# EAGLE design UBTB_MIX (EAGLE 9.4.2)
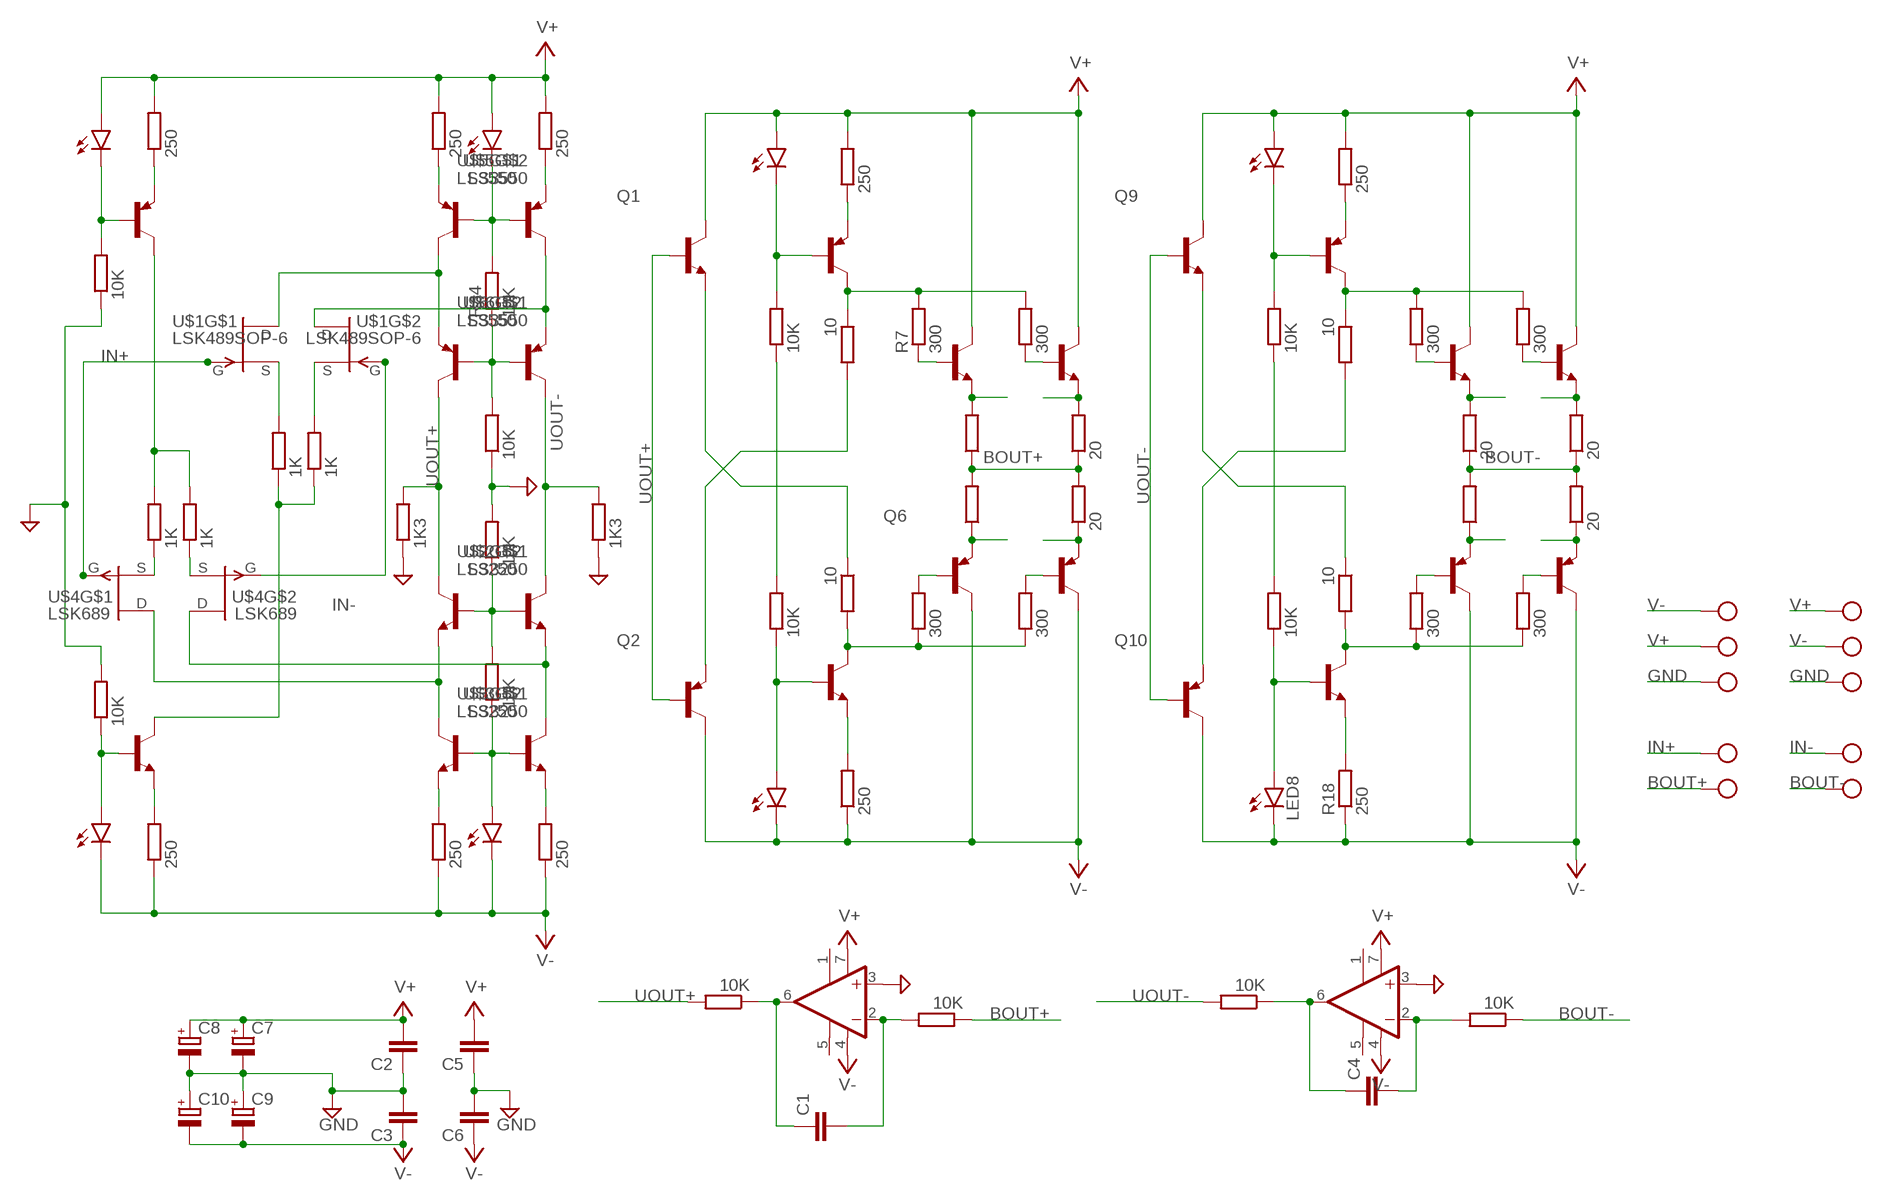
[diagram p0: schematic, sheet 1]

## Parts
C1  C-EUC1206  [C1206]
C2  C-EUC0805  [C0805]
C3  C-EUC0805  [C0805]
C4  C-EUC1206  [C1206]
C5  C-EUC0805  [C0805]
C6  C-EUC0805  [C0805]
C7  CPOL-EUF  [PANASONIC_F]
C8  CPOL-EUF  [PANASONIC_F]
C9  CPOL-EUF  [PANASONIC_F]
C10  CPOL-EUF  [PANASONIC_F]
IC1  OPA627U  [SO08]
IC2  OPA627U  [SO08]
LED1  LEDVWV1206  [LED_SML1206]
LED2  LEDVWV1206  [LED_SML1206]
LED3  LEDVWV1206  [LED_SML1206]
LED4  LEDVWV1206  [LED_SML1206]
LED5  LEDVWV1206  [LED_SML1206]
LED6  LEDVWV1206  [LED_SML1206]
LED7  LEDVWV1206  [LED_SML1206]
LED8  LEDVWV1206  [LED_SML1206]
Q1  TRANSISTOR_BC846-NPN-SOT23-BEC  [TRANSISTOR_SOT23-BEC]
Q2  TRANSISTOR_BC856B-PNP-SOT23-BEC  [TRANSISTOR_SOT23-BEC]
Q3  TRANSISTOR_BC846-NPN-SOT23-BEC  [TRANSISTOR_SOT23-BEC]
Q4  TRANSISTOR_BC856B-PNP-SOT23-BEC  [TRANSISTOR_SOT23-BEC]
Q5  TRANSISTOR_BC846-NPN-SOT23-BEC  [TRANSISTOR_SOT23-BEC]
Q6  TRANSISTOR_BC856B-PNP-SOT23-BEC  [TRANSISTOR_SOT23-BEC]
Q7  TRANSISTOR_BC856B-PNP-SOT23-BEC  [TRANSISTOR_SOT23-BEC]
Q8  TRANSISTOR_BC846-NPN-SOT23-BEC  [TRANSISTOR_SOT23-BEC]
Q9  TRANSISTOR_BC846-NPN-SOT23-BEC  [TRANSISTOR_SOT23-BEC]
Q10  TRANSISTOR_BC856B-PNP-SOT23-BEC  [TRANSISTOR_SOT23-BEC]
Q11  TRANSISTOR_BC846-NPN-SOT23-BEC  [TRANSISTOR_SOT23-BEC]
Q12  TRANSISTOR_BC856B-PNP-SOT23-BEC  [TRANSISTOR_SOT23-BEC]
Q13  TRANSISTOR_BC846-NPN-SOT23-BEC  [TRANSISTOR_SOT23-BEC]
Q14  TRANSISTOR_BC846-NPN-SOT23-BEC  [TRANSISTOR_SOT23-BEC]
Q15  TRANSISTOR_BC856B-PNP-SOT23-BEC  [TRANSISTOR_SOT23-BEC]
Q16  TRANSISTOR_BC856B-PNP-SOT23-BEC  [TRANSISTOR_SOT23-BEC]
Q17  TRANSISTOR_BC846-NPN-SOT23-BEC  [TRANSISTOR_SOT23-BEC]
Q18  TRANSISTOR_BC856B-PNP-SOT23-BEC  [TRANSISTOR_SOT23-BEC]
R1  250  R-EU_MELF0204W  [MINI_MELF-0204W]
R2  250  R-EU_MELF0204W  [MINI_MELF-0204W]
R3  10K  R-EU_MELF0204W  [MINI_MELF-0204W]
R4  10K  R-EU_MELF0204W  [MINI_MELF-0204W]
R5  10  R-EU_MELF0204W  [MINI_MELF-0204W]
R6  10  R-EU_MELF0204W  [MINI_MELF-0204W]
R7  300  R-EU_MELF0204W  [MINI_MELF-0204W]
R8  300  R-EU_MELF0204W  [MINI_MELF-0204W]
R9  300  R-EU_MELF0204W  [MINI_MELF-0204W]
R10  300  R-EU_MELF0204W  [MINI_MELF-0204W]
R11  R-EU_MELF0204W  [MINI_MELF-0204W]
R12  R-EU_MELF0204W  [MINI_MELF-0204W]
R13  20  R-EU_MELF0204W  [MINI_MELF-0204W]
R14  20  R-EU_MELF0204W  [MINI_MELF-0204W]
R15  250  R-EU_MELF0204W  [MINI_MELF-0204W]
R16  10K  R-EU_MELF0204W  [MINI_MELF-0204W]
R17  10K  R-EU_MELF0204W  [MINI_MELF-0204W]
R18  250  R-EU_MELF0204W  [MINI_MELF-0204W]
R19  10K  R-EU_MELF0204W  [MINI_MELF-0204W]
R20  10K  R-EU_MELF0204W  [MINI_MELF-0204W]
R21  10  R-EU_MELF0204W  [MINI_MELF-0204W]
R22  250  R-EU_MELF0204W  [MINI_MELF-0204W]
R23  250  R-EU_MELF0204W  [MINI_MELF-0204W]
R24  10  R-EU_MELF0204W  [MINI_MELF-0204W]
R25  300  R-EU_MELF0204W  [MINI_MELF-0204W]
R26  300  R-EU_MELF0204W  [MINI_MELF-0204W]
R27  300  R-EU_MELF0204W  [MINI_MELF-0204W]
R28  300  R-EU_MELF0204W  [MINI_MELF-0204W]
R29  10K  R-EU_MELF0204W  [MINI_MELF-0204W]
R30  20  R-EU_MELF0204W  [MINI_MELF-0204W]
R31  R-EU_MELF0204W  [MINI_MELF-0204W]
R32  10K  R-EU_MELF0204W  [MINI_MELF-0204W]
R33  10K  R-EU_MELF0204W  [MINI_MELF-0204W]
R34  10K  R-EU_MELF0204W  [MINI_MELF-0204W]
R35  250  R-EU_MELF0204W  [MINI_MELF-0204W]
R36  250  R-EU_MELF0204W  [MINI_MELF-0204W]
R37  1K3  R-EU_MELF0204W  [MINI_MELF-0204W]
R38  1K3  R-EU_MELF0204W  [MINI_MELF-0204W]
R39  1K  R-EU_MELF0204W  [MINI_MELF-0204W]
R40  1K  R-EU_MELF0204W  [MINI_MELF-0204W]
R41  1K  R-EU_MELF0204W  [MINI_MELF-0204W]
R42  1K  R-EU_MELF0204W  [MINI_MELF-0204W]
R43  250  R-EU_MELF0204W  [MINI_MELF-0204W]
R44  250  R-EU_MELF0204W  [MINI_MELF-0204W]
R45  10K  R-EU_MELF0204W  [MINI_MELF-0204W]
R46  10K  R-EU_MELF0204W  [MINI_MELF-0204W]
R47  20  R-EU_MELF0204W  [MINI_MELF-0204W]
R48  10K  R-EU_MELF0204W  [MINI_MELF-0204W]
R49  20  R-EU_MELF0204W  [MINI_MELF-0204W]
R51  10K  R-EU_MELF0204W  [MINI_MELF-0204W]
U$1  LSK489SOP-6  [SOT-23-6]
U$2  LS3250  [SOT-23-6]
U$3  LS3250  [SOT-23-6]
U$4  LSK689  [SOT-23-6]
U$5  LS3550  [SOT-23-6]
U$6  LS3550  [SOT-23-6]
X1  CON-PHOENIX-508_MKDSN1,5/3-5,08  [CON-PHOENIX-508_MKDSN1,5/3-5,08]
X2  CON-PHOENIX-508_MKDSN1,5/3-5,08  [CON-PHOENIX-508_MKDSN1,5/3-5,08]
X3  CON-PHOENIX-508_MKDSN1,5/2-5,08  [CON-PHOENIX-508_MKDSN1,5/2-5,08]
X4  CON-PHOENIX-508_MKDSN1,5/2-5,08  [CON-PHOENIX-508_MKDSN1,5/2-5,08]

## Nets
BOUT+: R11.1 R12.2 R13.1 R14.2 R17.1 X3.2
BOUT-: R30.1 R31.2 R47.1 R48.1 R49.2 X4.2
GND: C2.1 C3.2 C5.1 C6.2 C7.- C8.- C9.+ C10.+ IC1.3(+IN) IC2.3(+IN) R32.2 R33.1 R37.1 R38.1 R45.1 R46.2 X1.3 X2.3
IN+: U$1.1(G) U$4.1(G) X3.1
IN-: U$1.4(G) U$4.4(G) X4.1
N$1: C4.1 IC2.6(OUT) R51.1
N$2: R35.1 U$5.2(E)
N$3: C4.2 IC2.2(-IN) R48.2
N$4: Q2.E R5.2
N$5: Q3.E R2.2
N$6: Q4.E R1.1
N$7: LED5.C Q4.B R3.2
N$8: LED6.A Q3.B R4.1
N$9: Q4.C R5.1 R7.2 R10.2
N$10: Q3.C R6.2 R8.1 R9.1
N$11: Q1.E R6.1
N$12: R3.1 R4.2
N$13: Q5.B R7.1
N$14: Q5.E R11.2
N$15: Q7.B R9.2
N$16: Q8.B R10.1
N$17: Q6.B R8.2
N$18: Q6.E R12.1
N$19: C1.2 IC1.2(-IN) R17.2
N$20: Q8.E R13.2
N$21: Q7.E R14.1
N$22: C1.1 IC1.6(OUT) R16.1
N$23: R36.1 U$5.5(E)
N$25: Q11.E R18.2
N$26: Q12.E R15.1
N$27: LED7.C Q12.B R19.2
N$28: LED8.A Q11.B R20.1
N$29: Q12.C R21.1 R25.2 R28.2
N$30: Q11.C R24.2 R26.1 R27.1
N$31: Q10.E R21.2
N$32: Q9.E R24.1
N$33: R19.1 R20.2
N$34: Q13.B R25.1
N$35: Q15.B R26.2
N$36: Q14.B R28.1
N$37: Q16.B R27.2
N$38: Q13.E R30.2
N$39: Q15.E R31.1
N$41: Q14.E R47.2
N$42: Q16.E R49.1
N$93: R22.2 U$3.5(E)
N$94: R23.2 U$3.2(E)
N$95: U$2.2(E) U$3.4(C) U$4.5(D)
N$96: U$2.5(E) U$3.6(C) U$4.2(D)
N$97: LED1.A R29.1 U$3.1(B) U$3.3(B)
N$98: R29.2 R32.1 U$2.1(B) U$2.3(B)
N$101: R33.2 R34.1 U$6.1(B) U$6.3(B)
N$102: U$1.2(D) U$5.4(C) U$6.5(E)
N$103: LED2.C R34.2 U$5.1(B) U$5.3(B)
N$104: U$1.5(D) U$5.6(C) U$6.2(E)
N$108: LED3.C Q18.B R45.2
N$109: Q18.E R43.1
N$110: Q18.C R41.2 R42.2
N$111: R42.1 U$4.6(S)
N$112: R41.1 U$4.3(S)
N$115: R39.2 U$1.3(S)
N$116: R40.2 U$1.6(S)
N$117: Q17.C R39.1 R40.1
N$118: Q17.E R44.2
N$119: LED4.A Q17.B R46.1
UOUT+: Q1.B Q2.B R16.2 R37.2 U$2.6(C) U$6.6(C)
UOUT-: Q9.B Q10.B R38.2 R51.2 U$2.4(C) U$6.4(C)
V+: C2.2 C5.2 C7.+ C8.+ IC1.7(V+) IC2.7(V+) LED2.A LED3.A LED5.A LED7.A Q1.C Q5.C Q8.C Q9.C Q13.C Q14.C R1.2 R15.2 R35.2 R36.2 R43.2 X1.2 X2.1
V-: C3.1 C6.1 C9.- C10.- IC1.4(V-) IC2.4(V-) LED1.C LED4.C LED6.C LED8.C Q2.C Q6.C Q7.C Q10.C Q15.C Q16.C R2.1 R18.1 R22.1 R23.1 R44.1 X1.1 X2.2
Unconnected: IC1.1(TRIM1) IC1.5(TRIM2) IC2.1(TRIM1) IC2.5(TRIM2)

## Library data of the parts
C1-C6 = Vwvwbg:C-EU: CAPACITOR, European symbol
C7-C10 = Vwvwbg:CPOL-EU: POLARIZED CAPACITOR, European symbol
IC1 IC2 = burr-brown:OPA627: Difet(R) Operational Amplifiers Precision, High-Speed; MF: TEXAS INSTRUMENTS; MPN: OPA627AU; OC_FARNELL: 1207067; OC_NEWARK: 30C4516
LED1-LED3 LED5-LED8 = Vwvwbg:LED: LED OSRAM: - CHIPLED LG R971, LG N971, LY N971, LG Q971, LY Q971, LO R971, LY R971 LH N974, LH R974 LS Q976, LO Q976, LY Q976 LO Q996 - Hyper CHIPLED LW Q18S LB Q993, LB Q99A, LB R99A - SideLED LS A670, LO A670, LY A670, LG A670, LP A670 LB A673, LV A673, LT A673, LW A673 LH A674 LY A675 LS A676, LA A676, LO A676, LY A676, LW A676 LS A679, LY A679, LG A679 - Hyper Micro SIDELED® LS Y876, LA Y876, LO Y876, LY Y876 LT Y87S - SmartLED LW L88C, LW L88S LB L89C, LB L89S, LG L890 LS L89K, LO L89K, LY L89K LS L896, LA L896, LO L896, LY L896 - TOPLED LS T670, LO T670, LY T670, LG T670, LP T670 LSG T670, LSP T670, LSY T670, LOP T670, LYG T670 LG T671, LOG T671, LSG T671 LB T673, LV T673, LT T673, LW T673 LH T674 LS T676, LA T676, LO T676, LY T676, LB T676, LH T676, LSB T676, LW T676 LB T67C, LV T67C, LT T67C, LS T67K, LO T67K, LY T67K, LW E67C LS E67B, LA E67B, LO E67B, LY E67B, LB E67C, LV E67C, LT E67C LW T67C LS T679, LY T679, LG T679 LS T770, LO T770, LY T770, LG T770, LP T770 LB T773, LV T773, LT T773, LW T773 LH T774 LS E675, LA E675, LY E675, LS T675 LS T776, LA T776, LO T776, LY T776, LB T776 LHGB T686 LT T68C, LB T68C - Hyper Mini TOPLED® LB M676 - Mini TOPLED Santana® LG M470 LS M47K, LO M47K, LY M47K Source: http://www.osram.convergy.de LUXEON: - LUMILED® LXK2-PW12-R00, LXK2-PW12-S00, LXK2-PW14-U00, LXK2-PW14-V00 LXK2-PM12-R00, LXK2-PM12-S00, LXK2-PM14-U00 LXK2-PE12-Q00, LXK2-PE12-R00, LXK2-PE12-S00, LXK2-PE14-T00, LXK2-PE14-U00 LXK2-PB12-K00, LXK2-PB12-L00, LXK2-PB12-M00, LXK2-PB14-N00, LXK2-PB14-P00, LXK2-PB14-Q00 LXK2-PR12-L00, LXK2-PR12-M00, LXK2-PR14-Q00, LXK2-PR14-R00 LXK2-PD12-Q00, LXK2-PD12-R00, LXK2-PD12-S00 LXK2-PH12-R00, LXK2-PH12-S00 LXK2-PL12-P00, LXK2-PL12-Q00, LXK2-PL12-R00 Source: www.luxeon.com KINGBRIGHT: KA-3528ASYC Source: www.kingbright.com
LED4 = Vwvwbg:LED: LED OSRAM: - CHIPLED LG R971, LG N971, LY N971, LG Q971, LY Q971, LO R971, LY R971 LH N974, LH R974 LS Q976, LO Q976, LY Q976 LO Q996 - Hyper CHIPLED LW Q18S LB Q993, LB Q99A, LB R99A - SideLED LS A670, LO A670, LY A670, LG A670, LP A670 LB A673, LV A673, LT A673, LW A673 LH A674 LY A675 LS A676, LA A676, LO A676, LY A676, LW A676 LS A679, LY A679, LG A679 - Hyper Micro SIDELED® LS Y876, LA Y876, LO Y876, LY Y876 LT Y87S - SmartLED LW L88C, LW L88S LB L89C, LB L89S, LG L890 LS L89K, LO L89K, LY L89K LS L896, LA L896, LO L896, LY L896 - TOPLED LS T670, LO T670, LY T670, LG T670, LP T670 LSG T670, LSP T670, LSY T670, LOP T670, LYG T670 LG T671, LOG T671, LSG T671 LB T673, LV T673, LT T673, LW T673 LH T674 LS T676, LA T676, LO T676, LY T676, LB T676, LH T676, LSB T676, LW T676 LB T67C, LV T67C, LT T67C, LS T67K, LO T67K, LY T67K, LW E67C LS E67B, LA E67B, LO E67B, LY E67B, LB E67C, LV E67C, LT E67C LW T67C LS T679, LY T679, LG T679 LS T770, LO T770, LY T770, LG T770, LP T770 LB T773, LV T773, LT T773, LW T773 LH T774 LS E675, LA E675, LY E675, LS T675 LS T776, LA T776, LO T776, LY T776, LB T776 LHGB T686 LT T68C, LB T68C - Hyper Mini TOPLED® LB M676 - Mini TOPLED Santana® LG M470 LS M47K, LO M47K, LY M47K Source: http://www.osram.convergy.de LUXEON: - LUMILED® LXK2-PW12-R00, LXK2-PW12-S00, LXK2-PW14-U00, LXK2-PW14-V00 LXK2-PM12-R00, LXK2-PM12-S00, LXK2-PM14-U00 LXK2-PE12-Q00, LXK2-PE12-R00, LXK2-PE12-S00, LXK2-PE14-T00, LXK2-PE14-U00 LXK2-PB12-K00, LXK2-PB12-L00, LXK2-PB12-M00, LXK2-PB14-N00, LXK2-PB14-P00, LXK2-PB14-Q00 LXK2-PR12-L00, LXK2-PR12-M00, LXK2-PR14-Q00, LXK2-PR14-R00 LXK2-PD12-Q00, LXK2-PD12-R00, LXK2-PD12-S00 LXK2-PH12-R00, LXK2-PH12-S00 LXK2-PL12-P00, LXK2-PL12-Q00, LXK2-PL12-R00 Source: www.luxeon.com KINGBRIGHT: KA-3528ASYC Source: www.kingbright.com; SPICEPREFIX: D
Q1 Q3 Q5 Q8 Q9 Q11 Q13 Q14 Q17 = Vwvwbg:TRANSISTOR_*-NPN-: NPN Transistror BF959 corrected 2008.03.06
Q2 Q4 Q6 Q7 Q10 Q12 Q15 Q16 Q18 = Vwvwbg:TRANSISTOR_*-PNP-: PNP Transistror
R1-R43 R45-R49 R51 = Vwvwbg:R-EU_: RESISTOR, European symbol
R44 = Vwvwbg:R-EU_: RESISTOR, European symbol; SPICEPREFIX: R
U$1 = Vwvwbg:LSK489
U$2 U$3 = Vwvwbg:LS3250
U$4 = Vwvwbg:LSK689
U$5 U$6 = Vwvwbg:LS3550
X1 X2 = Vwvwbg:CON-PHOENIX-508_MKDSN1,5/3-5,08: MKDSN 1,5/ 3-5,08 Printklemme Nennstrom: 13,5 A Nennspannung: 250 V Rastermaß: 5,08 mm Polzahl: 3 Anschlussart: Schraubanschluss Montage: Löten Anschlussrichtung Leiter/Platine: 0 ° Artikelnummer: 1729131 Source: http://eshop.phoenixcontact.com .. 1729131.pdf
X3 X4 = Vwvwbg:CON-PHOENIX-508_MKDSN1,5/2-5,08: MKDSN 1,5/ 2-5,08 Printklemme Nennstrom: 13,5 A Nennspannung: 250 V Rastermaß: 5,08 mm Polzahl: 2 Anschlussart: Schraubanschluss Montage: Löten Anschlussrichtung Leiter/Platine: 0 ° Artikelnummer: 1729128 Source: http://eshop.phoenixcontact.com .. 1729128.pdf

## Board
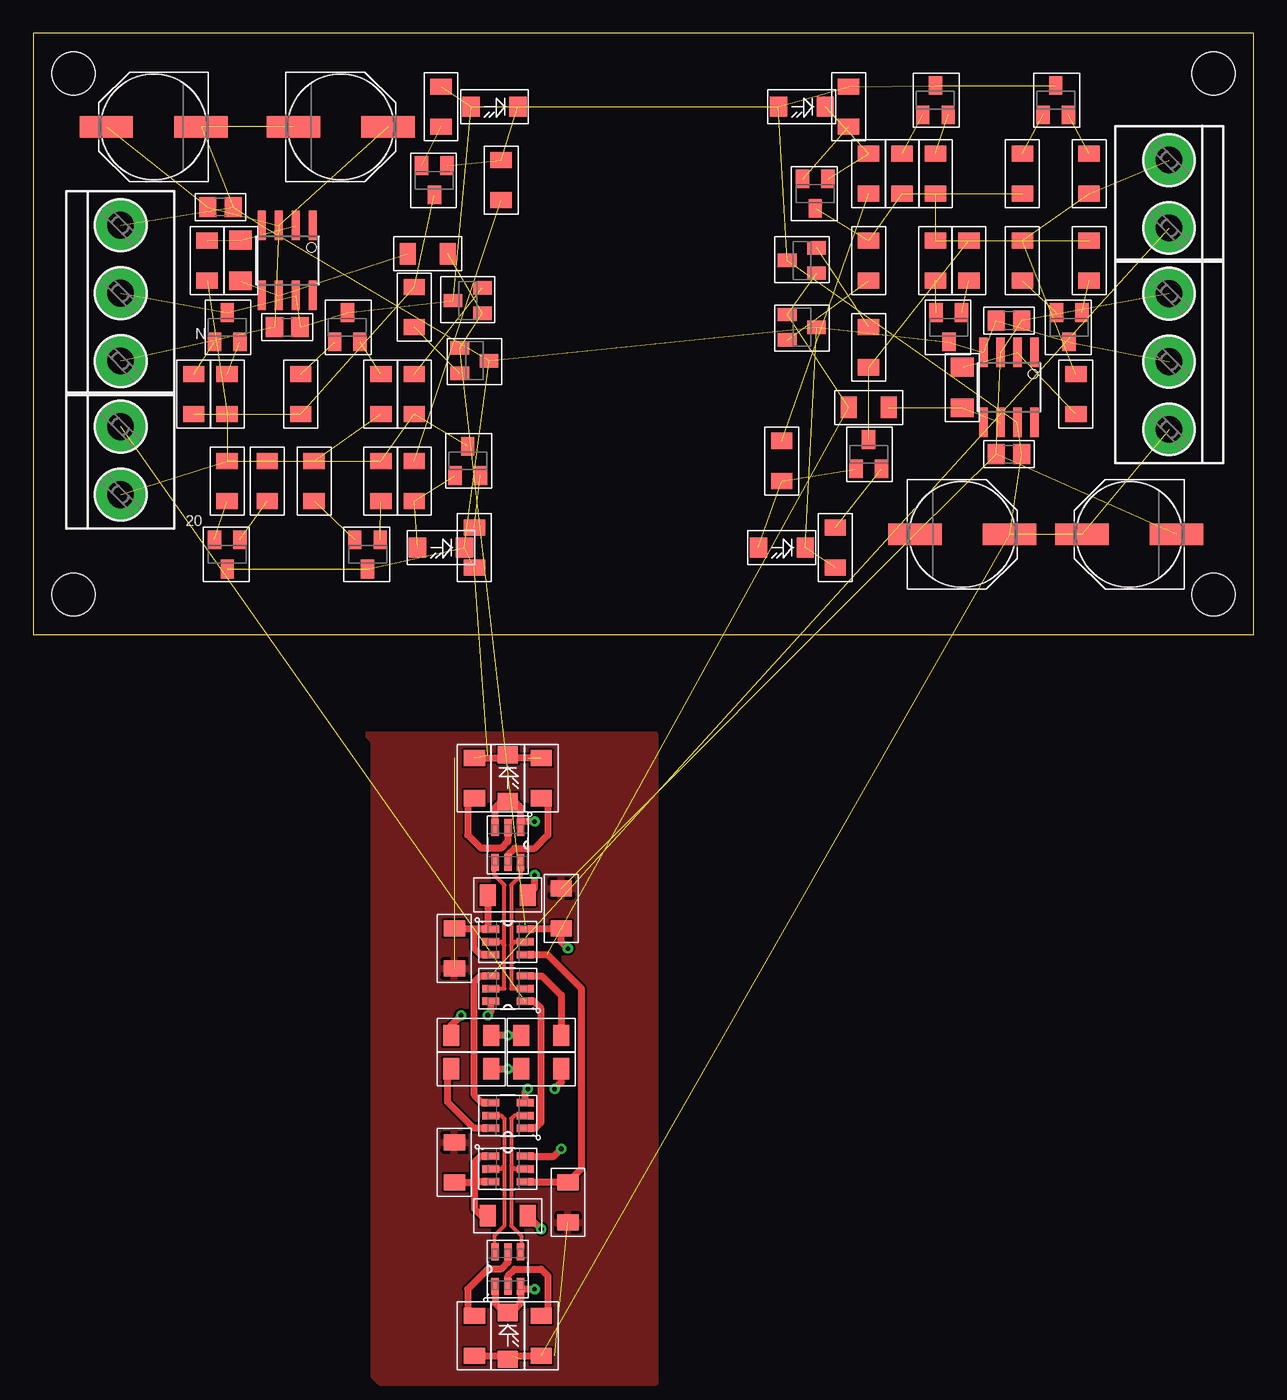
[diagram p1: board, top side]
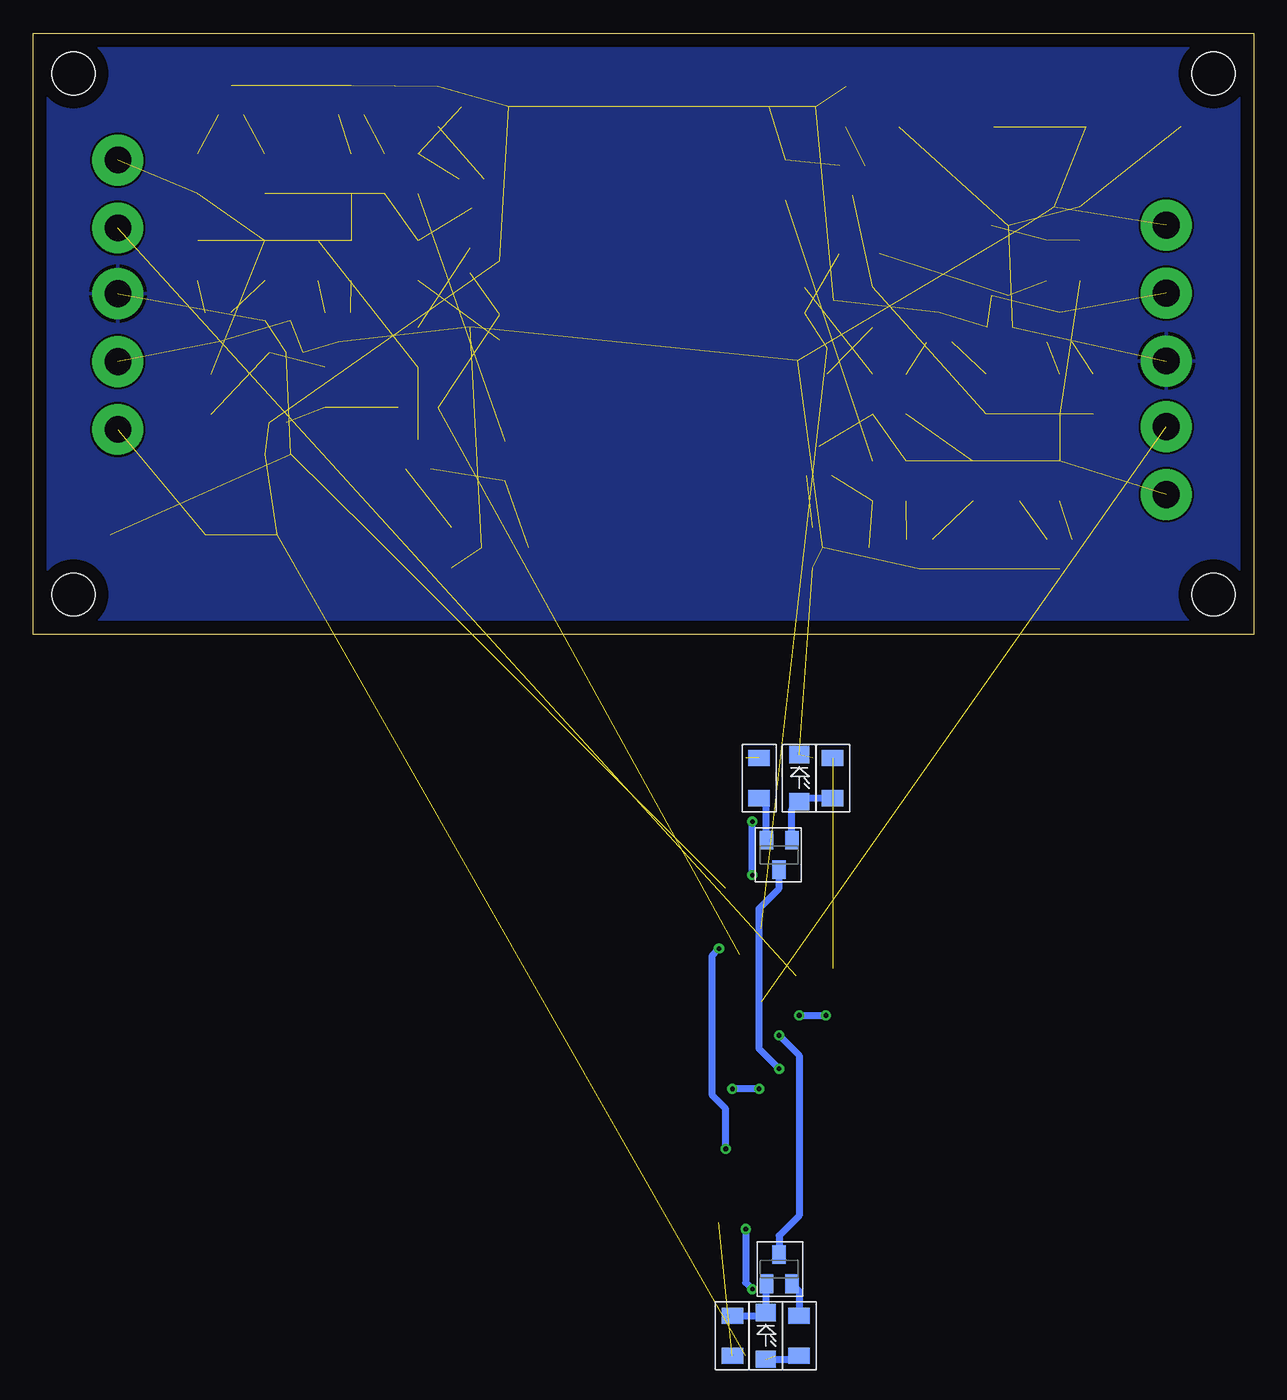
[diagram p2: board, bottom side, seen from below]

Size 91.3 x 45 mm. Coordinates in mm from the lower left corner, seen from the top.
Outline: 0,0 91.3,0 91.3,45 0,45 0,0
Copper layers (1*16): Top 0.035mm / dielectric 1.5mm / Bottom 0.035mm
Design rules "default *": minimum track width 6mil, minimum drill 0.35mm, track to track 6mil, track to pad 6mil, pad to pad 6mil, via to via 6mil, smd to smd 6mil, copper to edge 40mil, drill to drill 6mil, minimum pad ring 10mil, minimum via ring 8mil, stop-mask expansion 4mil, vias tented up to drill 0.35mm, thermal gap 10mil
Holes 3.2 mm at 3,42 88.3,3 88.3,42 3,3

### Footprints (pad centres in the part's own frame; a part is rotated, then mirrored left to right if it is on the bottom)
C1206 = smd 1.4 x 1.7: 1 -1.527,0; 2 1.527,0
C0805 = smd 1.3 x 1.5: 1 -0.95,0; 2 0.95,0
PANASONIC_F = smd 4 x 1.6: + 3.55,0; - -3.55,0
SO08 = smd 0.61 x 2.21: 1 -1.905,-2.616; 2 -0.635,-2.616; 3 0.635,-2.616; 4 1.905,-2.616; 5 1.905,2.616; 6 0.635,2.616; 7 -0.635,2.616; 8 -1.905,2.616
LED_SML1206 = smd 1.3 x 1.5: A 1.75,0; C -1.75,0
TRANSISTOR_SOT23-BEC = smd 1 x 1.4: B -0.95,-1.1; C 0,1.1; E 0.95,-1.1
MINI_MELF-0204W = smd 1.2 x 1.6: 1 -1.5,0; 2 1.5,0
SOT-23-6 = smd 1.27 x 0.559: 1 -1.295,0.95; 2 -1.295,0; 3 -1.295,-0.95; 4 1.295,-0.95; 5 1.295,0; 6 1.295,0.95
CON-PHOENIX-508_MKDSN1,5/3-5,08 = drill 2 pad 3.81: 1 -7.641,0.025; 2 -2.561,0.025; 3 2.519,0.025
CON-PHOENIX-508_MKDSN1,5/2-5,08 = drill 2 pad 3.81: 1 -2.561,0.025; 2 2.519,0.025

### Placement (x,y rotation side)
C1  15.5,28 90 top
C2  73,13.5 0 top
C3  14,32 180 top
C4  69.5,18.5 90 top
C5  19,23 0 top
C6  73,23.5 0 top
C7  69.5,7.5 0 top
C8  82,7.5 180 top
C9  23,38 0 top
C10  9,38 180 top
IC1  19,28 180 top
IC2  73,18.5 180 top
LED1  35.5,-10.75 270 top  (outside the outline)
LED2  35.5,-52.5 270 top  (outside the outline)
LED3  36.5,-52.5 270 bottom  (outside the outline)
LED4  34,-10.75 270 bottom  (outside the outline)
LED5  34.5,39.5 180 top
LED6  30.5,6.5 180 top
LED7  57.5,39.5 180 top
LED8  56,6.5 180 top
Q1  32.5,25 90 top
Q2  33,20.5 270 top
Q3  32.5,13 0 top
Q4  30,34 180 top
Q5  14.5,23 0 top
Q6  14.5,6 180 top
Q7  25,6 180 top
Q8  23.5,23 0 top
Q9  57.5,28 90 top
Q10  57.5,23 270 top
Q11  62.5,13.5 0 top
Q12  58.5,33 180 top
Q13  67.5,40 0 top
Q14  76.5,40 0 top
Q15  68.5,23 180 top
Q16  77.5,23 180 top
Q17  35.5,-16.5 180 bottom  (outside the outline)
Q18  35.5,-47.5 0 bottom  (outside the outline)
R1  30.5,39.5 90 top
R2  33,6.5 90 top
R3  35,34 90 top
R4  28.5,11.5 90 top
R5  28.5,24.5 270 top
R6  28.5,18 270 top
R7  12,18 270 top
R8  17.5,11.5 270 top
R9  26,11.5 270 top
R10  20,18 270 top
R11  14.5,18 90 top
R12  14.5,11.5 90 top
R13  26,18 90 top
R14  21,11.5 90 top
R15  61,39.5 90 top
R16  29.5,28.5 0 top
R17  13,28 90 top
R18  60,6.5 90 top
R19  62.5,34.5 90 top
R20  56,13 90 top
R21  62.5,28 270 top
R22  38,-10.75 270 top  (outside the outline)
R23  33,-10.75 270 top  (outside the outline)
R24  62.5,21.5 270 top
R25  65,34.5 270 top
R26  70,28 270 top
R27  79,28 270 top
R28  74,34.5 270 top
R29  35.5,-19.5 180 top  (outside the outline)
R30  67.5,34.5 90 top
R31  67.5,28 90 top
R32  31.5,-23.5 270 top  (outside the outline)
R33  31.5,-39.5 270 top  (outside the outline)
R34  35.5,-43.5 0 top  (outside the outline)
R35  38,-52.5 270 top  (outside the outline)
R36  33,-52.5 270 top  (outside the outline)
R37  39.5,-20.5 270 top  (outside the outline)
R38  40,-42.5 90 top  (outside the outline)
R39  38,-32.5 0 top  (outside the outline)
R40  32.75,-32.5 180 top  (outside the outline)
R41  38,-30 180 top  (outside the outline)
R42  32.75,-30 0 top  (outside the outline)
R43  34,-52.5 270 bottom  (outside the outline)
R44  37,-10.75 270 bottom  (outside the outline)
R45  39,-52.5 90 bottom  (outside the outline)
R46  31.5,-10.75 90 bottom  (outside the outline)
R47  79,34.5 90 top
R48  78,18 270 top
R49  74,28 90 top
R51  62.5,17 180 top
U$1  35.5,-36 180 top  (outside the outline)
U$2  35.5,-23 0 top  (outside the outline)
U$3  35.5,-15.75 270 top  (outside the outline)
U$4  35.5,-26.5 180 top  (outside the outline)
U$5  35.5,-47.5 90 top  (outside the outline)
U$6  35.5,-40 0 top  (outside the outline)
X1  6.5,23 270 top
X2  85,23 90 top
X3  6.5,13 270 top
X4  85,33 90 top

### Tracks (layer width: path | path; a pad name or v marks a point on that pad's centre or on a via)
BOUT+  (5 unrouted)
BOUT-  (5 unrouted)
GND  (13 unrouted)
  pour Bottom: 0,46.99 91.44,46.99 91.44,-2.54 0,-2.54
  pour Top: 25,-7.5 46.5,-7.5 46.5,-56 26,-56 25.5,-55.5 25.5,-8
IN+  (1 unrouted)
  Top 0.508: U$1.1 37.55,-36.95 38,-36.5 38,-28 37.45,-27.45 U$4.1
IN-  (1 unrouted)
  Top 0.508: U$1.4 33.55,-35.05 33,-34.5 33,-26 33.45,-25.55 U$4.4
N$1  (2 unrouted)
N$2
  Top 0.508: U$5.2 35.5,-48 36,-47.5 38,-47.5 38.5,-48 38.5,-50.5 R35.1
N$3  (2 unrouted)
N$4  (1 unrouted)
N$5  (1 unrouted)
N$6  (1 unrouted)
N$7  (2 unrouted)
N$8  (2 unrouted)
N$9  (3 unrouted)
N$10  (3 unrouted)
N$11  (1 unrouted)
N$12  (1 unrouted)
N$13  (1 unrouted)
N$14  (1 unrouted)
N$15  (1 unrouted)
N$16  (1 unrouted)
N$17  (1 unrouted)
N$18  (1 unrouted)
N$19  (2 unrouted)
N$20  (1 unrouted)
N$21  (1 unrouted)
N$22  (2 unrouted)
N$23
  Top 0.508: U$5.5 35.5,-47 35,-47.5 34,-47.5 32.5,-49 32.5,-51 R36.1
N$25  (1 unrouted)
N$26  (1 unrouted)
N$27  (2 unrouted)
N$28  (2 unrouted)
N$29  (3 unrouted)
N$30  (3 unrouted)
N$31  (1 unrouted)
N$32  (1 unrouted)
N$33  (1 unrouted)
N$34  (1 unrouted)
N$35  (1 unrouted)
N$36  (1 unrouted)
N$37  (1 unrouted)
N$38  (1 unrouted)
N$39  (1 unrouted)
N$41  (1 unrouted)
N$42  (1 unrouted)
N$93
  Top 0.508: U$3.5 35.5,-16.5 36,-16 37.5,-16 38.5,-15 38.5,-12.25 R22.2
N$94
  Top 0.508: U$3.2 35.5,-15.5 35,-16 33.5,-16 32.5,-15 32.5,-12.25 R23.2
N$95
  Top 0.305: U$4.5 35.25,-26.5 35.25,-23.25 | 35.25,-23.25 35,-23 U$2.2 | 35.25,-23.25 35.25,-18.75 34.5,-18 34.5,-17.09 U$3.4
N$96
  Top 0.305: U$2.5 36,-23 35.75,-23.25 | 35.75,-23.25 35.75,-26.5 U$4.2 | U$3.6 36.45,-18.05 35.75,-18.75 35.75,-23.25
N$97  (via drill 0.35)
  Top 0.508: U$3.3 34.55,-12.95 35,-12.5 LED1.A 36,-12.5 36.45,-12.95 36.45,-14 | U$3.1 36.45,-14 | R29.1 37.5,-19 v37.5,-18 | v37.5,-14 36.45,-14
  Bottom 0.508: v37.5,-18 v37.5,-14
N$98
  Top 0.508: R32.1 33,-22 | 33,-22 34.16,-22 | 34.16,-22 U$2.1 | U$2.3 33.45,-23.95 33,-23.5 33,-22 | R29.2 34,-21.84 34.16,-22
N$101
  Top 0.508: U$6.1 33.45,-39.05 33,-39.5 33,-41 | 33,-41 33,-43 33.5,-43.5 R34.1 | U$6.3 33.05,-40.95 33,-41 | R33.2 33,-41
N$102
  Top 0.305: U$1.2 36,-36 35.75,-36.25 35.75,-39.75 | 35.75,-39.75 36,-40 U$6.5 | 35.75,-39.75 35.75,-44.25 36.5,-45 36.5,-46.16 U$5.4
N$103  (via drill 0.35)
  Top 0.508: U$5.1 34.55,-50.05 35.25,-50.75 LED2.C 35.75,-50.75 36.45,-50.05 U$5.3 36.66,-49 v37.5,-49 | R34.2 v38,-44.5
  Bottom 0.508: v38,-44.5 38,-48.5 v37.5,-49
N$104
  Top 0.305: U$1.5 35,-36 35.25,-36.25 35.25,-39.75 | 35.25,-39.75 35,-40 U$6.2 | 35.25,-39.75 35.25,-44.25 34.5,-45 34.5,-46.16 U$5.6
N$108
  Bottom 0.508: Q18.B 36.5,-48.65 LED3.C 36.75,-51 R45.2
N$109
  Bottom 0.508: Q18.E 34,-49.15 R43.1
N$110  (via drill 0.35)
  Top 0.508: R42.2 v35.5,-30 R41.2
  Bottom 0.508: v35.5,-30 34,-31.5 34,-43.5 35.5,-45 Q18.C
N$111  (via drill 0.35)
  Top 0.305: 31.25,-29.25 R42.1
  Top 0.508: U$4.6 34.2,-28.3 v34,-28.5 | v32,-28.5 31.25,-29.25
  Bottom 0.508: v34,-28.5 v32,-28.5
N$112
  Top 0.508: U$4.3 38.05,-25.55 39.5,-27 R41.1
N$115  (via drill 0.35)
  Top 0.508: U$1.3 36.8,-34.2 v37,-34 | v39,-34 39.5,-33.5 R39.2
  Bottom 0.508: v37,-34 v39,-34
N$116
  Top 0.305: 31,-32.75 R40.2
  Top 0.508: U$1.6 32.95,-36.95 31,-35 31,-32.75
N$117  (via drill 0.35)
  Top 0.508: R39.1 v35.5,-32.5 R40.1
  Bottom 0.508: v35.5,-32.5 37,-31 37,-20.5 35.5,-19 Q17.C
N$118
  Bottom 0.508: R44.2 36.5,-12.75 36.5,-15.35 Q17.E
N$119
  Bottom 0.508: Q17.B 34.55,-13.05 LED4.A 33.75,-12.25 R46.1
UOUT+  (via drill 0.35)  (3 unrouted)
  Top 0.508: U$2.6 36.84,-22 R37.2 39.5,-23 v40,-23.5 | v39.5,-38.5 38.95,-39.05 U$6.6
  Bottom 0.508: v39.5,-38.5 39.5,-35.5 40.5,-34.5 40.5,-24 v40,-23.5
UOUT-  (3 unrouted)
  Top 0.508: U$6.4 39.45,-40.95 R38.2 41,-40 41,-26.5 38.45,-23.95 U$2.4
V+  (19 unrouted)
  Top 0.508: R36.2 35.25,-54 LED2.A 35.75,-54 R35.2
  Bottom 0.508: LED3.A 34.25,-54.25 R43.2
V-  (20 unrouted)
  Top 0.508: R22.1 35.75,-9.25 | 35.75,-9.25 LED1.C | R23.1 35.75,-9.25

### Text on the board
tPlace: N | 20